# EAGLE schematic G (EAGLE 9.6.2)
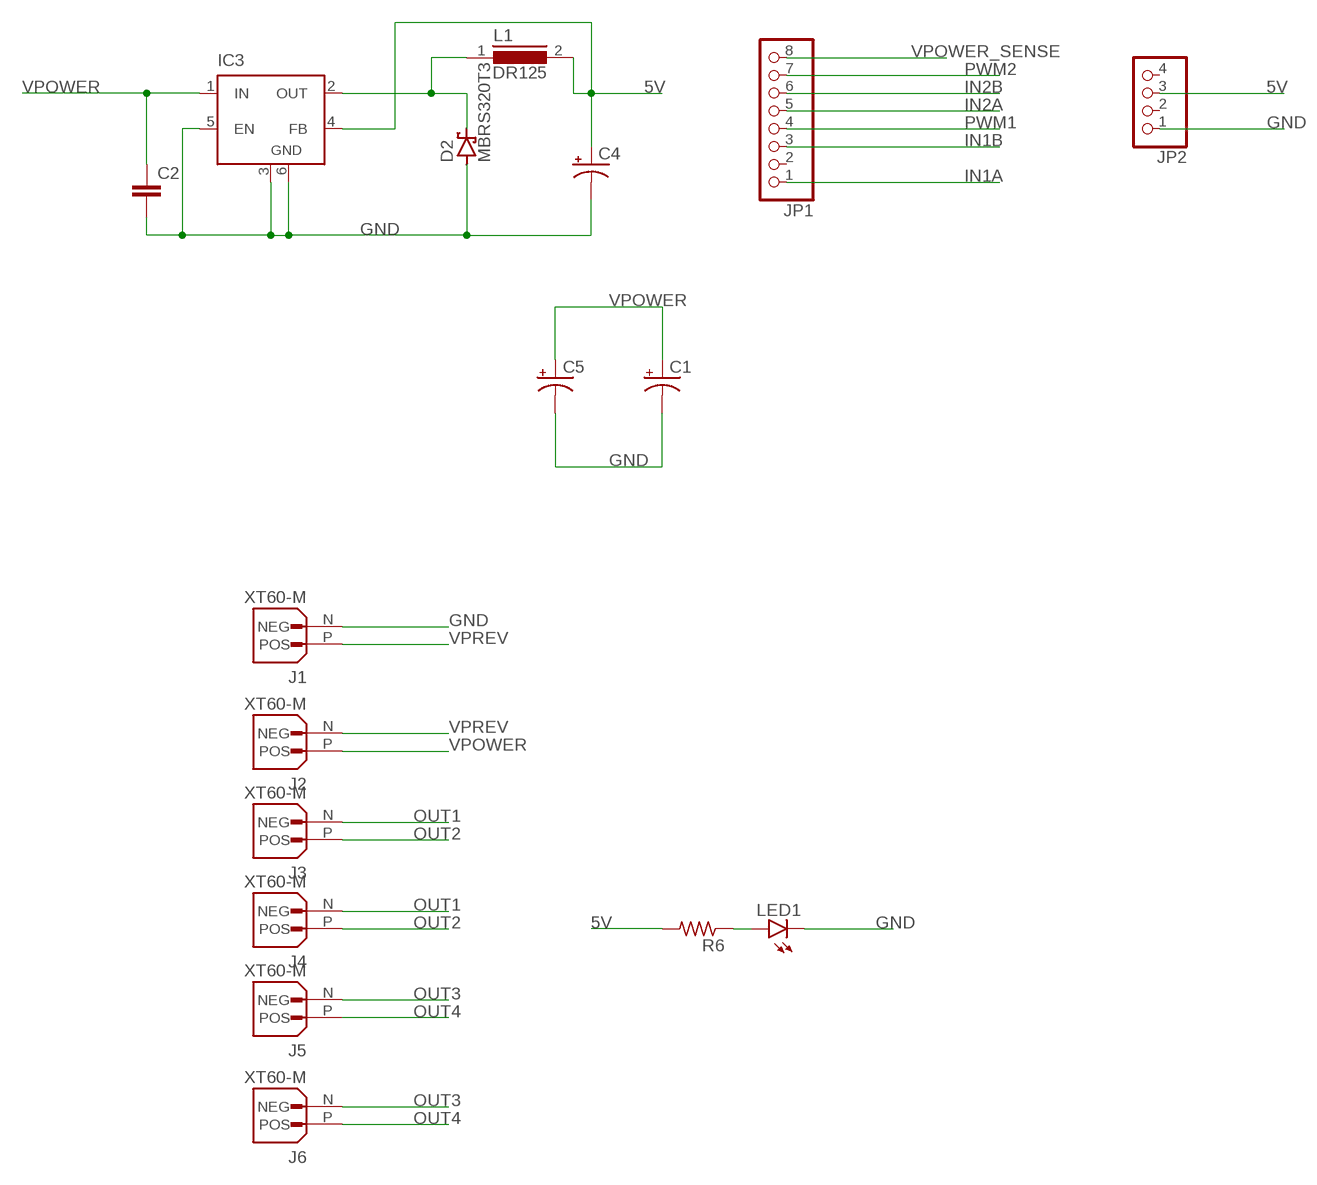
[diagram p0: schematic, sheet 1, part 1 of 2]
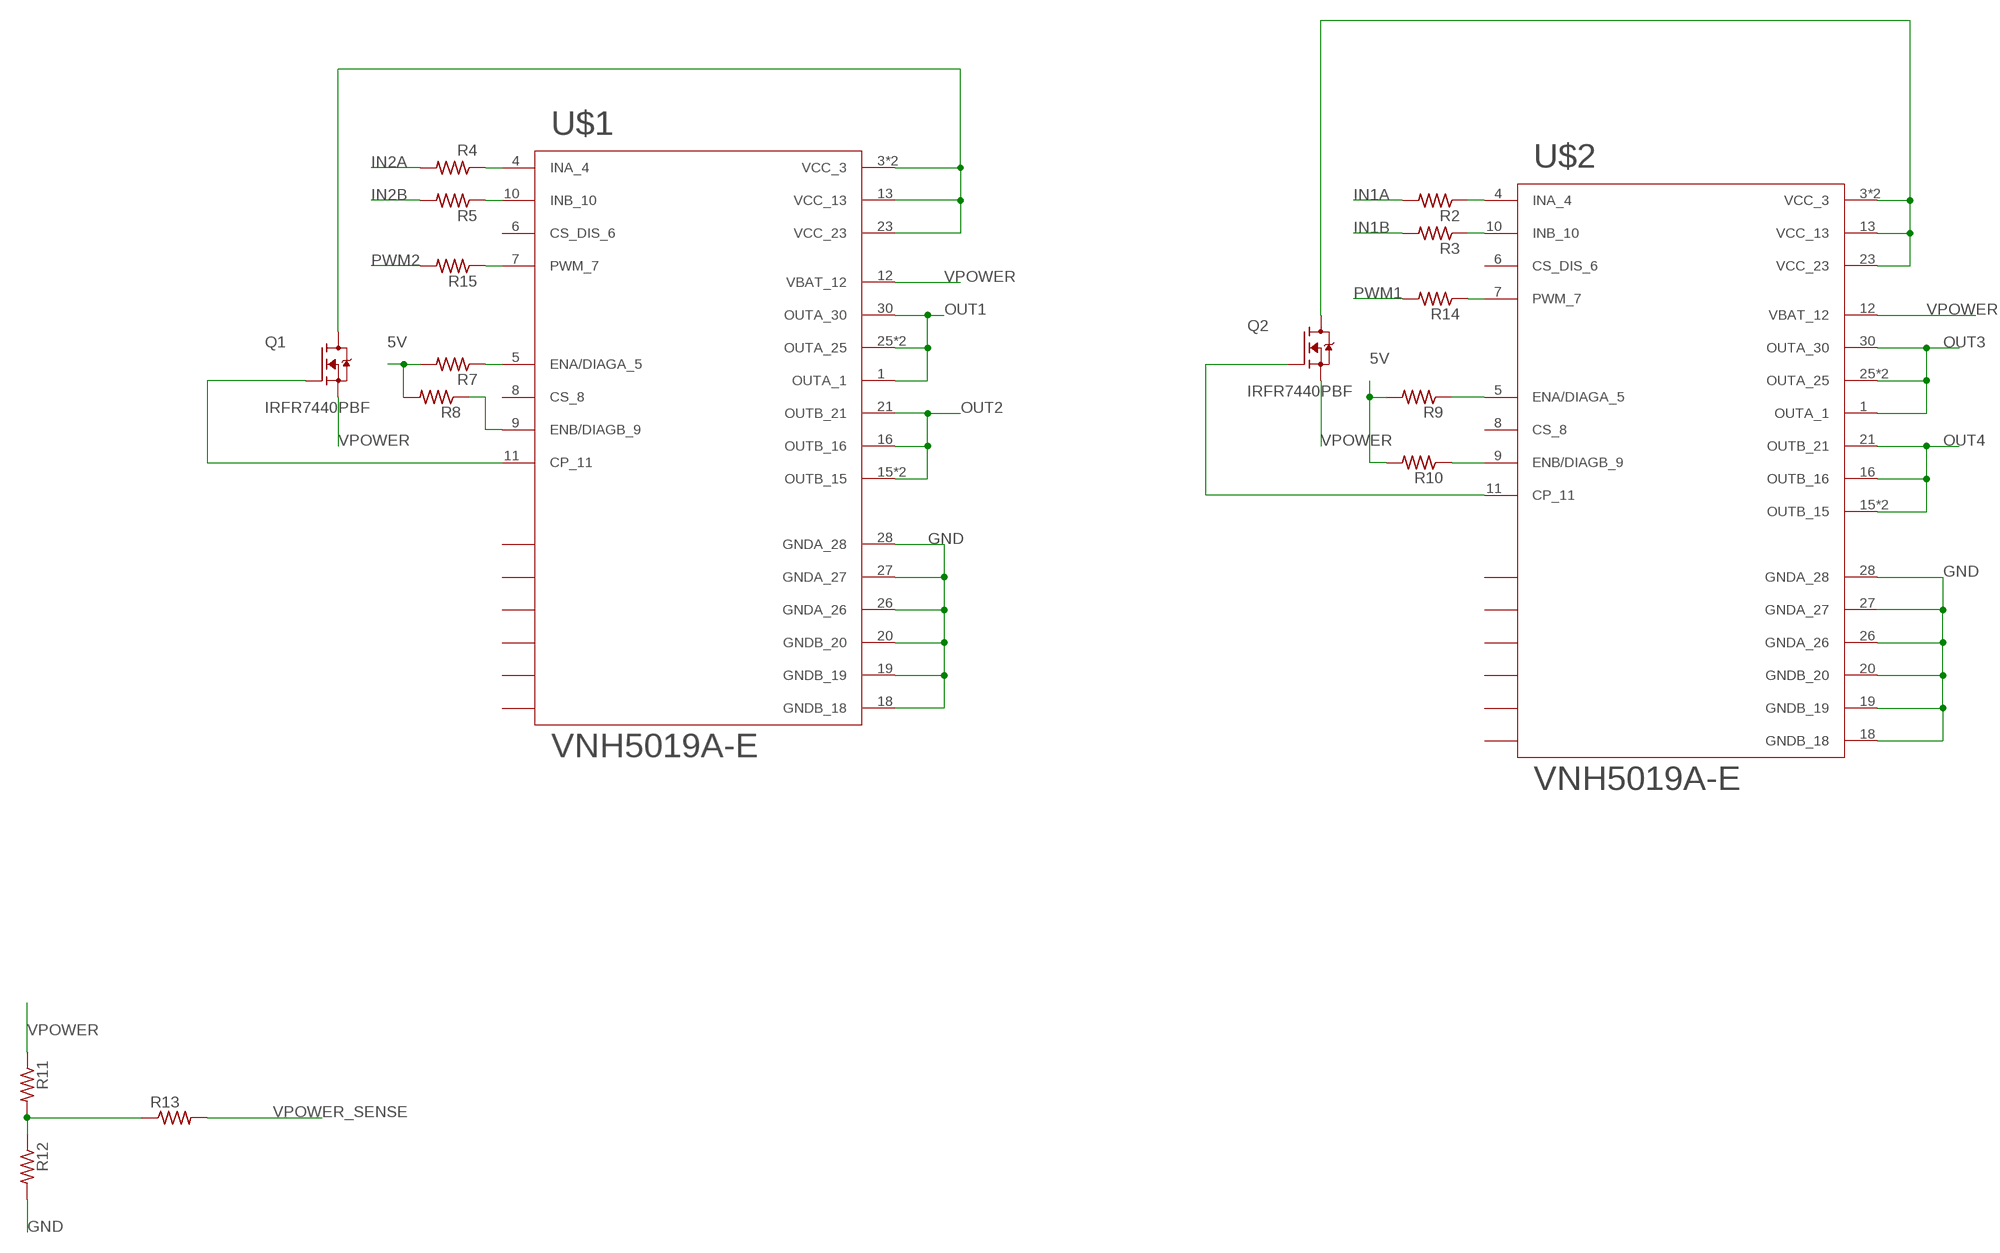
[diagram p1: schematic, sheet 1, part 2 of 2]

## Parts
C1  CPOL-US153CLV-1014  [153CLV-1014]
C2  C2.5/5  [C2.5-5]
C4  CAP_POLH13  [PANASONIC_H13]
C5  CPOL-US153CLV-1014  [153CLV-1014]
D2  MBRS320T3  [SMC]
IC3  LM2596S  [TO263-5]
J1  XT60-M  [AMASS_XT60-M]
J2  XT60-M  [AMASS_XT60-M]
J3  XT60-M  [AMASS_XT60-M]
J4  XT60-M  [AMASS_XT60-M]
J5  XT60-M  [AMASS_XT60-M]
J6  XT60-M  [AMASS_XT60-M]
JP1  PINHD-1X8/90  [1X08/90]
JP2  PINHD-1X4/90  [1X04/90]
L1  DR125  [DR125]
LED1  LEDSML1206  [SML1206]
Q1  IRFR7440PBF  [TO229P990X239-3N]
Q2  IRFR7440PBF  [TO229P990X239-3N]
R2  R-US_M1206  [M1206]
R3  R-US_M1206  [M1206]
R4  R-US_M1206  [M1206]
R5  R-US_M1206  [M1206]
R6  R-US_M1206  [M1206]
R7  R-US_M1206  [M1206]
R8  R-US_M1206  [M1206]
R9  R-US_M1206  [M1206]
R10  R-US_M1206  [M1206]
R11  R-US_M1206  [M1206]
R12  R-US_M1206  [M1206]
R13  R-US_M1206  [M1206]
R14  R-US_M1206  [M1206]
R15  R-US_M1206  [M1206]
U$1  VNH5019A-E  [IC_MULTIPOWERSO-30TR]
U$2  VNH5019A-E  [IC_MULTIPOWERSO-30TR]

## Nets
5V: C4.+ IC3.4(FB) JP2.3 L1.2 R6.2 R7.2 R8.2 R9.2 R10.2
GND: C1.- C2.2 C4.- C5.- D2.A IC3.3(GND) IC3.5(EN) IC3.6(GND) J1.N(NEG) JP2.1 LED1.C R12.2 U$1.18(GNDB_18) U$1.19(GNDB_19) U$1.20(GNDB_20) U$1.26(GNDA_26) U$1.27(GNDA_27) U$1.28(GNDA_28) U$2.19(GNDB_19) U$2.20(GNDB_20) U$2.26(GNDA_26) U$2.27(GNDA_27) U$2.28(GNDA_28)
IN1A: JP1.1 R2.2
IN1B: JP1.3 R3.2
IN2A: JP1.5 R4.2
IN2B: JP1.6 R5.2
N$1: Q1.1(G) U$1.11(CP_11)
N$2: R7.1 U$1.5(ENA/DIAGA_5)
N$4: LED1.A R6.1
N$5: R8.1 U$1.9(ENB/DIAGB_9)
N$6: R9.1 U$2.5(ENA/DIAGA_5)
N$7: R10.1 U$2.9(ENB/DIAGB_9)
N$8: R11.2 R12.1 R13.1
N$9: R4.1 U$1.4(INA_4)
N$10: R5.1 U$1.10(INB_10)
N$11: R2.1 U$2.4(INA_4)
N$12: R3.1 U$2.10(INB_10)
N$13: D2.C IC3.2(OUT) L1.1
N$14: R15.1 U$1.7(PWM_7)
N$15: R14.1 U$2.7(PWM_7)
N$16: Q1.4(D) U$1.3(VCC_3) U$1.13(VCC_13) U$1.23(VCC_23) U$1.HS1(VCC_3)
N$17: Q2.1(G) U$2.11(CP_11)
N$18: Q2.4(D) U$2.3(VCC_3) U$2.13(VCC_13) U$2.23(VCC_23) U$2.HS1(VCC_3)
N$24: U$2.18(GNDB_18)
OUT1: J3.N(NEG) J4.N(NEG) U$1.1(OUTA_1) U$1.25(OUTA_25) U$1.30(OUTA_30) U$1.HS2(OUTA_25)
OUT2: J3.P(POS) J4.P(POS) U$1.15(OUTB_15) U$1.16(OUTB_16) U$1.21(OUTB_21) U$1.HS3(OUTB_15)
OUT3: J5.N(NEG) J6.N(NEG) U$2.1(OUTA_1) U$2.25(OUTA_25) U$2.30(OUTA_30) U$2.HS2(OUTA_25)
OUT4: J5.P(POS) J6.P(POS) U$2.15(OUTB_15) U$2.16(OUTB_16) U$2.21(OUTB_21) U$2.HS3(OUTB_15)
PWM1: JP1.4 R14.2
PWM2: JP1.7 R15.2
VPOWER: C1.+ C2.1 C5.+ IC3.1(IN) J2.P(POS) Q1.3(S) Q2.3(S) R11.1 U$1.12(VBAT_12) U$2.12(VBAT_12)
VPOWER_SENSE: JP1.8 R13.2
VPREV: J1.P(POS) J2.N(NEG)
Unconnected: JP1.2 JP2.2 JP2.4 U$1.2(N.C._2) U$1.6(CS_DIS_6) U$1.8(CS_8) U$1.14(NC_14) U$1.17(NC_17) U$1.22(NC_22) U$1.24(NC_24) U$1.29(N.C._29) U$2.2(N.C._2) U$2.6(CS_DIS_6) U$2.8(CS_8) U$2.14(NC_14) U$2.17(NC_17) U$2.22(NC_22) U$2.24(NC_24) U$2.29(N.C._29)

## Library data of the parts
C1 C5 = adafruit:CPOL-US: POLARIZED CAPACITOR, American symbol
C2 = capacitor-wima-enhanced:C: CAPACITOR naming: grid - package width
C4 = SparkFun-Capacitors:CAP_POL: Capacitor Polarized These are standard SMD and PTH capacitors. Normally 10uF, 47uF, and 100uF in electrolytic and tantalum varieties. Always verify the external diameter of the through hole cap, it varies with capacity, voltage, and manufacturer. The EIA devices should be standard.
D2 = diode:MBRS3*0T3: SCHOTTKY BARRIER RECTIFIER 3.0 AMPERES 20, 30, 40 VOLT Source: MBRS340T3-D.pdf
IC3 = linear:LM2596S: STEP-DOWN VOLTAGE REGULATOR
J1-J6 = XT60-M:XT60-M: Check availability <https://pricing.snapeda.com/parts/XT60-M/AMASS/view-part?ref=eda>; AVAILABILITY: Not in stock; CHECK_PRICES: https://www.snapeda.com/parts/XT60-M/AMASS/view-part/?ref=eda; DESCRIPTION: Plug; DC supply; XT60; male; PIN: 2; for cable; soldered; 30A; 500V; MF: AMASS; MP: XT60-M; PACKAGE: Package; PRICE: None; SNAPEDA_LINK: https://www.snapeda.com/parts/XT60-M/AMASS/view-part/?ref=snap
JP1 = pinhead-enhanced-2:PINHD-1X8: PIN HEADER
JP2 = pinhead-enhanced:PINHD-1X4: PIN HEADER
L1 = inductors:DR125: High Power Density, High Efficiency, Shielded Inductors Source: coiltronics_dr_series.pdf; SPICEPREFIX: L
LED1 = led:LED: LED OSRAM: - CHIPLED LG R971, LG N971, LY N971, LG Q971, LY Q971, LO R971, LY R971 LH N974, LH R974 LS Q976, LO Q976, LY Q976 LO Q996 - Hyper CHIPLED LW Q18S LB Q993, LB Q99A, LB R99A - SideLED LS A670, LO A670, LY A670, LG A670, LP A670 LB A673, LV A673, LT A673, LW A673 LH A674 LY A675 LS A676, LA A676, LO A676, LY A676, LW A676 LS A679, LY A679, LG A679 - Hyper Micro SIDELED® LS Y876, LA Y876, LO Y876, LY Y876 LT Y87S - SmartLED LW L88C, LW L88S LB L89C, LB L89S, LG L890 LS L89K, LO L89K, LY L89K LS L896, LA L896, LO L896, LY L896 - TOPLED LS T670, LO T670, LY T670, LG T670, LP T670 LSG T670, LSP T670, LSY T670, LOP T670, LYG T670 LG T671, LOG T671, LSG T671 LB T673, LV T673, LT T673, LW T673 LH T674 LS T676, LA T676, LO T676, LY T676, LB T676, LH T676, LSB T676, LW T676 LB T67C, LV T67C, LT T67C, LS T67K, LO T67K, LY T67K, LW E67C LS E67B, LA E67B, LO E67B, LY E67B, LB E67C, LV E67C, LT E67C LW T67C LS T679, LY T679, LG T679 LS T770, LO T770, LY T770, LG T770, LP T770 LB T773, LV T773, LT T773, LW T773 LH T774 LS E675, LA E675, LY E675, LS T675 LS T776, LA T776, LO T776, LY T776, LB T776 LHGB T686 LT T68C, LB T68C - Hyper Mini TOPLED® LB M676 - Mini TOPLED Santana® LG M470 LS M47K, LO M47K, LY M47K Source: http://www.osram.convergy.de LUXEON: - LUMILED® LXK2-PW12-R00, LXK2-PW12-S00, LXK2-PW14-U00, LXK2-PW14-V00 LXK2-PM12-R00, LXK2-PM12-S00, LXK2-PM14-U00 LXK2-PE12-Q00, LXK2-PE12-R00, LXK2-PE12-S00, LXK2-PE14-T00, LXK2-PE14-U00 LXK2-PB12-K00, LXK2-PB12-L00, LXK2-PB12-M00, LXK2-PB14-N00, LXK2-PB14-P00, LXK2-PB14-Q00 LXK2-PR12-L00, LXK2-PR12-M00, LXK2-PR14-Q00, LXK2-PR14-R00 LXK2-PD12-Q00, LXK2-PD12-R00, LXK2-PD12-S00 LXK2-PH12-R00, LXK2-PH12-S00 LXK2-PL12-P00, LXK2-PL12-Q00, LXK2-PL12-R00 Source: www.luxeon.com KINGBRIGHT: KA-3528ASYC Source: www.kingbright.com
Q1 Q2 = IRFR7440PBF:IRFR7440PBF: Check availability <https://pricing.snapeda.com/parts/IRFR7440PBF/Infineon%20Technologies/view-part?ref=eda>; AVAILABILITY: In Stock; CHECK_PRICES: https://www.snapeda.com/parts/IRFR7440PBF/Infineon+Technologies/view-part/?ref=eda; DESCRIPTION: RoHS Compliant | Improved Gate, Avalanche and Dynamic dV/dt Ruggedness | Fully Characterized Capacitance and Avalanche SOA | Enhanced body diode dV/dt and dI/dt Capability; MF: Infineon Technologies; MP: IRFR7440PBF; PACKAGE: TO-252 Infineon; PRICE: None; SNAPEDA_LINK: https://www.snapeda.com/parts/IRFR7440PBF/Infineon+Technologies/view-part/?ref=snap
R2-R15 = rcl:R-US_: RESISTOR, American symbol; SPICEPREFIX: R
U$1 U$2 = VNH5019A-E:VNH5019A-E: Automotive fully integrated H-bridge motor driver Description: The VHN5019A-E is a full bridge motor driver intended for a wide range of automotive applications. The device incorporates a dual monolithic high-side drivers and two low-side switches. The high-side driver switch is designed using STMicroelectronics’ well known and proven proprietary VIPower® M0 technology that allows to efficiently integrate on the same die a true Power MOSFET with an intelligent signal/protection circuit. Features : AEC-Q100 qualified ECOPACK®: lead free and RoHS compliant Output current: 30 A 3 V CMOS compatible inputs Undervoltage and overvoltage shutdown High-side and low-side thermal shutdown Cross-conduction protection Current limitation Very low standby power consumption PWM operation up to 20 kHz Protection against: Loss of ground and loss of VCC Current sense output proportional to motor current Charge pump output for reverse polarity protection Output protected against short to ground and short to VCC Check availability <https://pricing.snapeda.com/parts/VNH5019A-E/STMicroelectronics/view-part?ref=eda>; AVAILABILITY: In Stock; CHECK_PRICES: https://www.snapeda.com/parts/VNH5019A-E/STMicroelectronics/view-part/?ref=eda; DESCRIPTION: - Motor Driver Power MOSFET Parallel, PWM MultiPowerSO-30; MF: STMicroelectronics; MP: VNH5019A-E; PACKAGE: PowerSOP-30 STMicroelectronics; PRICE: None; PURCHASE-URL: https://www.snapeda.com/api/url_track_click_mouser/?unipart_id=231156&manufacturer=STMicroelectronics&part_name=VNH5019A-E&search_term=None; SNAPEDA_LINK: https://www.snapeda.com/parts/VNH5019A-E/STMicroelectronics/view-part/?ref=snap